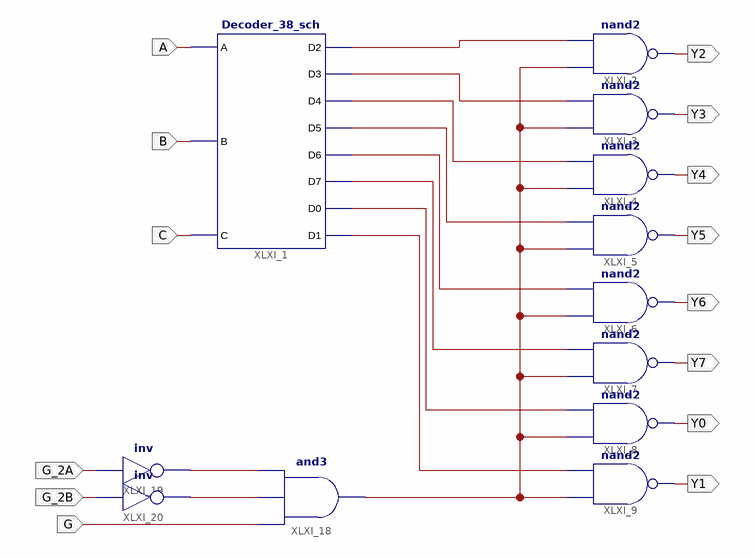
[diagram p0: schematic sheet 1]
// Xilinx ISE schematic HCT138_sch.sch (kintex7) as structural Verilog: 12 symbols, 14 ports
module HCT138_sch (
  input  G,
  input  A,
  input  B,
  input  C,
  input  G_2B,
  input  G_2A,
  output Y2,
  output Y3,
  output Y4,
  output Y5,
  output Y6,
  output Y7,
  output Y0,
  output Y1
);

  wire XLXN_1, XLXN_2, XLXN_3, XLXN_4, XLXN_5, XLXN_6, XLXN_7, XLXN_8, XLXN_9, XLXN_10, XLXN_18;

  Decoder_38_sch XLXI_1 (
    .A(A), .B(B), .C(C), .D2(XLXN_1), .D3(XLXN_2), .D4(XLXN_3), .D5(XLXN_4), .D6(XLXN_5), .D7(XLXN_6),
    .D0(XLXN_7), .D1(XLXN_8));
  nand XLXI_6 (Y6, XLXN_18, XLXN_5);
  nand XLXI_7 (Y7, XLXN_18, XLXN_6);
  nand XLXI_8 (Y0, XLXN_18, XLXN_7);
  nand XLXI_9 (Y1, XLXN_18, XLXN_8);
  nand XLXI_2 (Y2, XLXN_18, XLXN_1);
  nand XLXI_3 (Y3, XLXN_18, XLXN_2);
  nand XLXI_4 (Y4, XLXN_18, XLXN_3);
  nand XLXI_5 (Y5, XLXN_18, XLXN_4);
  and XLXI_18 (XLXN_18, G, XLXN_10, XLXN_9);
  not XLXI_19 (XLXN_9, G_2A);
  not XLXI_20 (XLXN_10, G_2B);
endmodule
